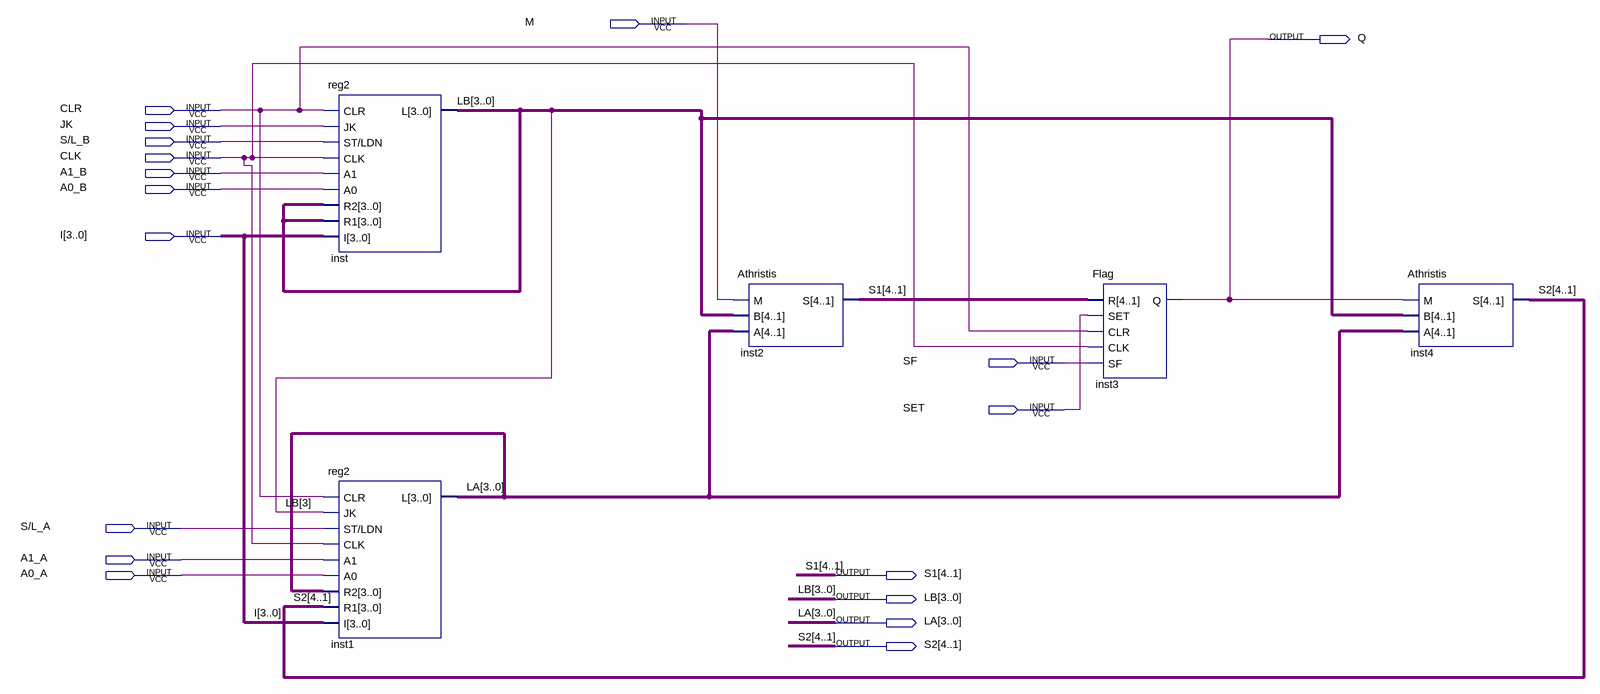
[diagram p0: schematic sheet]
// Quartus schematic datapath2.bdf as structural Verilog: 5 symbols, 18 pins
module datapath2 (
  input  M,
  input  CLR,
  input  JK,
  input  \S/L_B ,
  input  CLK,
  input  A1_B,
  input  A0_B,
  input  [3:0] I,
  input  SF,
  input  SET,
  input  \S/L_A ,
  input  A1_A,
  input  A0_A,
  output Q,
  output [4:1] S1,
  output [3:0] LB,
  output [3:0] LA,
  output [4:1] S2
);

  reg2 inst (.CLR(CLR), .JK(JK), .\ST/LDN (\S/L_B ), .CLK(CLK), .A1(A1_B), .A0(A0_B), .R2(LB), .R1(LB), .I(I), .L(LB));
  reg2 inst1 (
    .CLR(CLR), .JK(LB[3]), .\ST/LDN (\S/L_A ), .CLK(CLK), .A1(A1_A), .A0(A0_A), .R2(LA), .R1(S2), .I(I),
    .L(LA));
  Athristis inst2 (.M(M), .B(LB), .A(LA), .S(S1));
  Flag inst3 (.R(S1), .SET(SET), .CLR(CLR), .CLK(CLK), .SF(SF), .Q(Q));
  Athristis inst4 (.M(Q), .B(LB), .A(LA), .S(S2));
endmodule
